# EAGLE schematic audio_proto (EAGLE 7.5.0)
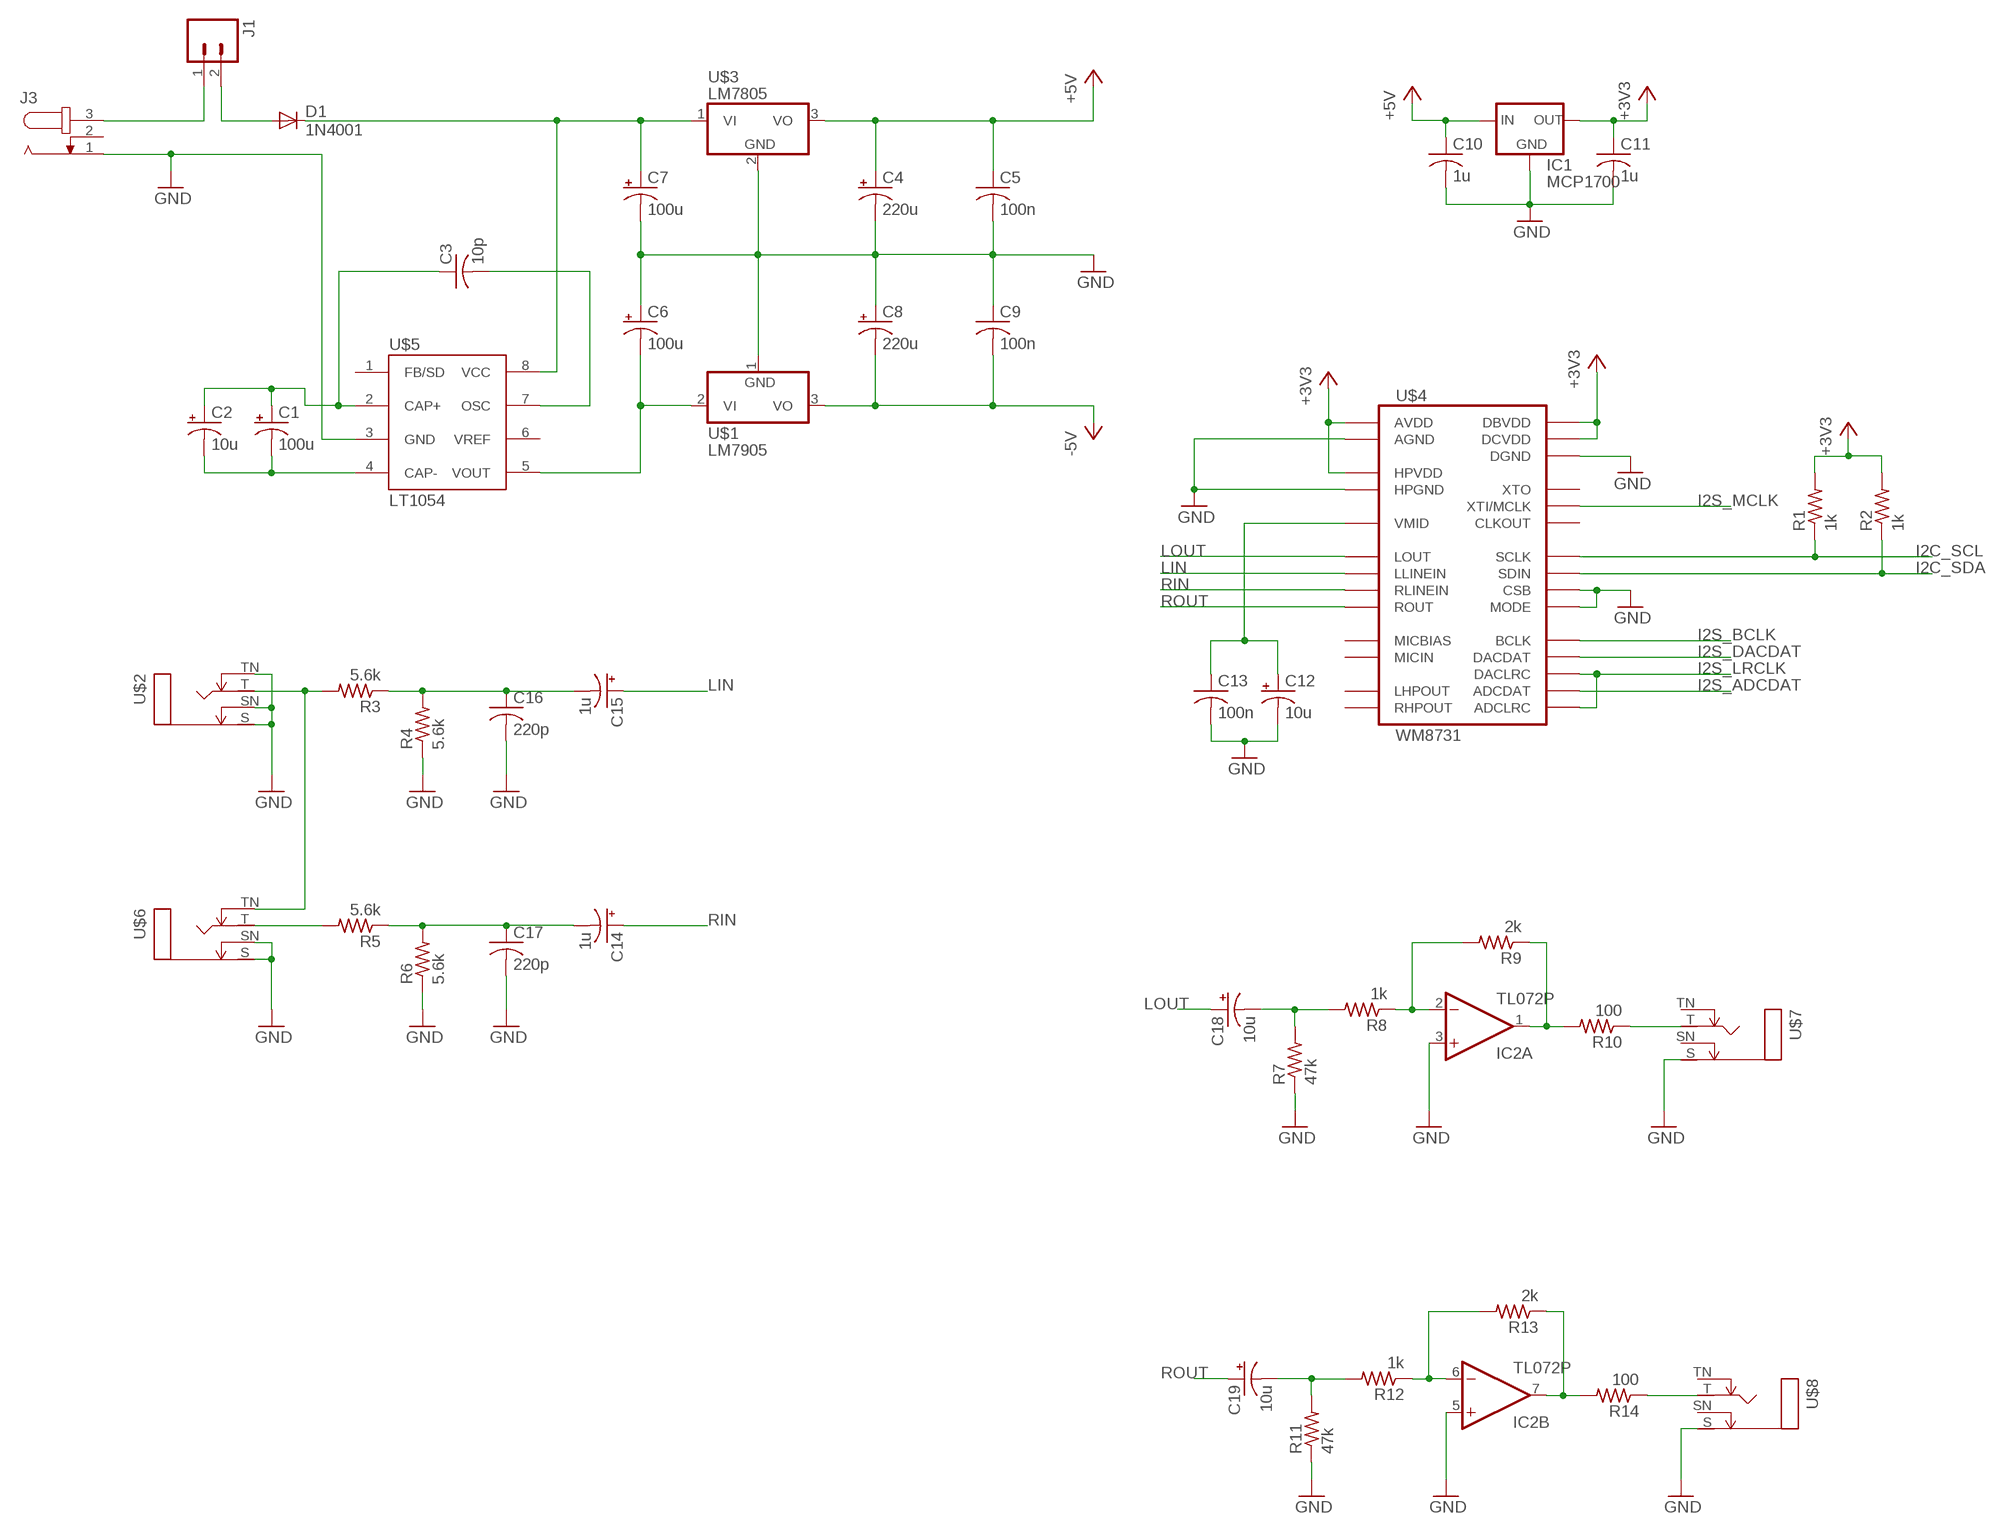
[diagram p0: schematic, sheet 1]

## Parts
C1  100u  CPOL-USE2.5-6  [E2,5-6]
C2  10u  CPOL-USE2.5-5  [E2,5-5]
C3  10p  C-US025-025X050  [C025-025X050]
C4  220u  CPOL-USE5-10.5  [E5-10,5]
C5  100n  C-US025-025X050  [C025-025X050]
C6  100u  CPOL-USE2.5-6  [E2,5-6]
C7  100u  CPOL-USE2.5-6  [E2,5-6]
C8  220u  CPOL-USE5-10.5  [E5-10,5]
C9  100n  C-US025-025X050  [C025-025X050]
C10  1u  C-US025-025X050  [C025-025X050]
C11  1u  C-US025-025X050  [C025-025X050]
C12  10u  CPOL-USE2.5-5  [E2,5-5]
C13  100n  C-US025-025X050  [C025-025X050]
C14  1u  CPOL-USE2.5-6  [E2,5-6]
C15  1u  CPOL-USE2.5-6  [E2,5-6]
C16  220p  C-US025-025X050  [C025-025X050]
C17  220p  C-US025-025X050  [C025-025X050]
C18  10u  CPOL-USE2.5-6  [E2,5-6]
C19  10u  CPOL-USE2.5-6  [E2,5-6]
D1  1N4001  1N4004  [DO41-10]
IC1  MCP1700  MCP1700INLINE  [TO92-INLINE]
IC2  TL072P  [DIL08]
J1  M02PTH  [1X02]
J3  JACK-PLUG2  [SPC4077]
R1  1k  R-US_0207/10  [0207/10]
R2  1k  R-US_0207/10  [0207/10]
R3  5.6k  R-US_0207/10  [0207/10]
R4  5.6k  R-US_0207/10  [0207/10]
R5  5.6k  R-US_0207/10  [0207/10]
R6  5.6k  R-US_0207/10  [0207/10]
R7  47k  R-US_0207/10  [0207/10]
R8  1k  R-US_0207/10  [0207/10]
R9  2k  R-US_0207/10  [0207/10]
R10  100  R-US_0207/10  [0207/10]
R11  47k  R-US_0207/10  [0207/10]
R12  1k  R-US_0207/10  [0207/10]
R13  2k  R-US_0207/10  [0207/10]
R14  100  R-US_0207/10  [0207/10]
U$1  LM7905  [TO220V]
U$2  MONOJACKSW  [NMJ4HCD2]
U$3  LM7805  [TO220V]
U$4  WM8731  [DIL28-6]
U$5  LT1054  [DIL08]
U$6  MONOJACKSW  [NMJ4HCD2]
U$7  MONOJACKSW  [NMJ4HCD2]
U$8  MONOJACKSW  [NMJ4HCD2]

## Nets
+3V3: C11.1 IC1.3(OUT) R1.2 R2.2 U$4.1(DBVDD) U$4.8(HPVDD) U$4.14(AVDD) U$4.27(DCVDD)
+5V: C4.+ C5.1 C10.1 IC1.2(IN) U$3.3(VO)
-5V: C8.- C9.2 U$1.3(VO)
GND: C4.- C5.2 C6.+ C7.- C8.+ C9.1 C10.2 C11.2 C12.- C13.2 C16.2 C17.2 IC1.1(GND) IC2.3(A:+IN) IC2.5(B:+IN) J3.1 R4.1 R6.1 R7.1 R11.1 U$1.1(GND) U$2.S U$2.SN U$2.TN U$3.2(GND) U$4.11(HPGND) U$4.15(AGND) U$4.21(MODE) U$4.22(CSB) U$4.28(DGND) U$5.3(GND) U$6.S U$6.SN U$7.S U$8.S
I2C_SCL: R1.1 U$4.24(SCLK)
I2C_SDA: R2.1 U$4.23(SDIN)
I2S_ADCDAT: U$4.6(ADCDAT)
I2S_BCLK: U$4.3(BCLK)
I2S_DACDAT: U$4.4(DACDAT)
I2S_LRCLK: U$4.5(DACLRC) U$4.7(ADCLRC)
I2S_MCLK: U$4.25(XTI/MCLK)
LIN: C15.+ U$4.20(LLINEIN)
LOUT: C18.+ U$4.12(LOUT)
N$1: J1.1 J3.3
N$2: D1.A J1.2
N$3: R3.2 U$2.T U$6.TN
N$4: C3.2 U$5.7(OSC)
N$5: C1.+ C2.+ C3.1 U$5.2(CAP+)
N$6: C1.- C2.- U$5.4(CAP-)
N$7: C7.+ D1.C U$3.1(VI) U$5.8(VCC)
N$8: C15.- C16.1 R3.1 R4.2
N$9: C6.- U$1.2(VI) U$5.5(VOUT)
N$10: C12.+ C13.1 U$4.16(VMID)
N$11: R5.2 U$6.T
N$12: C14.- C17.1 R5.1 R6.2
N$13: C18.- R7.2 R8.2
N$14: IC2.2(A:-IN) R8.1 R9.2
N$15: IC2.1(A:OUT) R9.1 R10.2
N$16: R10.1 U$7.T
N$17: C19.- R11.2 R12.2
N$18: IC2.6(B:-IN) R12.1 R13.2
N$19: IC2.7(B:OUT) R13.1 R14.2
N$20: R14.1 U$8.T
RIN: C14.+ U$4.19(RLINEIN)
ROUT: C19.+ U$4.13(ROUT)
Unconnected: J3.2 U$4.2(CLKOUT) U$4.9(LHPOUT) U$4.10(RHPOUT) U$4.17(MICBIAS) U$4.18(MICIN) U$4.26(XTO) U$5.1(FB/SD) U$5.6(VREF) U$7.SN U$7.TN U$8.SN U$8.TN

## Power pins joined to a net without a drawn wire
V+: IC2.8(P:V+)
V-: IC2.4(P:V-)

## Library data of the parts
C1 C2 C4 C6-C8 C12 C14 C15 C18 C19 = rcl:CPOL-US: POLARIZED CAPACITOR, American symbol
C3 C5 C9-C11 C13 C16 C17 = rcl:C-US: CAPACITOR, American symbol
D1 = diode:1N4004: DIODE general purpose rectifier, 1 A
IC1 = mankell-proto:MCP1700: VOLTAGE REGULATOR
IC2 = linear:TL072: OP AMP
J1 = mankell-proto:M02: Standard 2-pin 0.1" header. Use with - straight break away headers ( PRT-00116) - right angle break away headers (PRT-00553) - swiss pins (PRT-00743) - machine pins (PRT-00117) - female headers (PRT-00115) Molex polarized connector foot print use with: PRT-08233 with associated crimp pins and housings. 2.54_SCREWTERM for use with PRT-10571. 3.5mm Screw Terminal footprints for PRT-08084 5mm Screw Terminal footprints for use with PRT-08432
J3 = mankell-proto:JACK-PLUG2: DC POWER JACK Power Jack, DC, Right Angle, Through Hole, Rated 5A at 16VDC, PC Terminals Distributor: Farnell (www.Farnell.de) Drawing: 84N1161.pdf / 84N1162.pdf Manufacturer: SPC Technology (www.spctechnology.com) Type: SPC4077 / SPC 4078
R1-R14 = rcl:R-US_: RESISTOR, American symbol
U$1 = mankell-proto:LM7905
U$2 U$6-U$8 = mankell-proto:MONOJACKSW
U$3 = mankell-proto:LM7805
U$4 = mankell-proto:WM8731
U$5 = mankell-proto:LT1054